# Altium schematic sheet MCU.SchDoc
size Letter; Organization: Altium Limited; Address1: L3, 12a Rodborough Rd; Address2: Frenchs Forest; Address3: NSW; Address4: Australia 2086
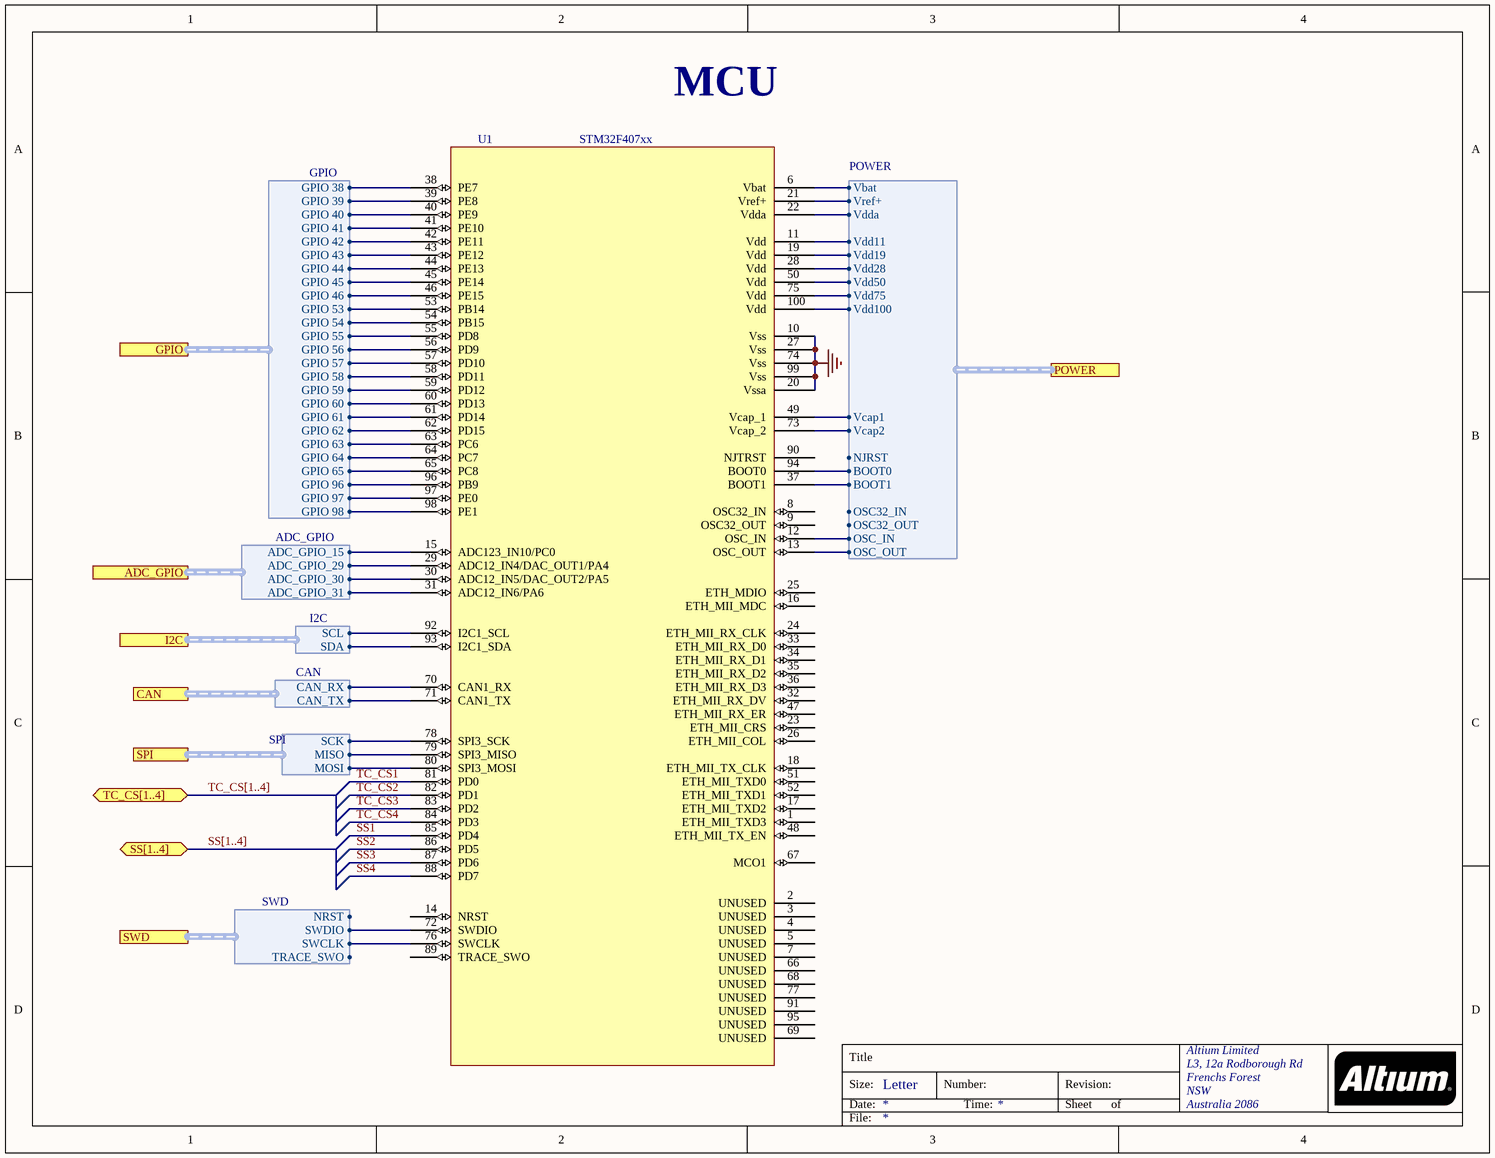
[diagram p0: MCU.SchDoc]

## Parts
U1  STM32F407xx  [LQFP100]

## Ports
ADC_GPIO (harness ADC_GPIO), CAN (harness CAN), GPIO (harness GPIO), I2C (harness I2C), POWER (harness POWER), SPI (harness SPI), SS[1..4] (bidir), SWD (harness SWD), TC_CS[1..4] (bidir)

## Harnesses
I2C: SCL, SDA
GPIO: GPIO 38, GPIO 39, GPIO 40, GPIO 41, GPIO 42, GPIO 43, GPIO 44, GPIO 45, GPIO 46, GPIO 53, GPIO 54, GPIO 55, GPIO 56, GPIO 57, GPIO 58, GPIO 59, GPIO 60, GPIO 61, GPIO 62, GPIO 63, GPIO 64, GPIO 65, GPIO 96, GPIO 97, GPIO 98
ADC_GPIO: ADC_GPIO_15, ADC_GPIO_29, ADC_GPIO_30, ADC_GPIO_31
CAN: CAN_RX, CAN_TX
SWD: NRST, SWDIO, SWCLK, TRACE_SWO
POWER: Vbat, Vref+, Vdda, Vcap1, Vcap2, NJRST, BOOT0, BOOT1, OSC32_IN, OSC32_OUT, OSC_IN, OSC_OUT, Vdd11, Vdd19, Vdd28, Vdd50, Vdd75, Vdd100
SPI: SCK, MISO, MOSI

## Nets
GND: U1.10(Vss) U1.20(Vssa) U1.27(Vss) U1.74(Vss) U1.99(Vss)
SS1: U1.85(PD4)
SS2: U1.86(PD5)
SS3: U1.87(PD6)
SS4: U1.88(PD7)
TC_CS1: U1.81(PD0)
TC_CS2: U1.82(PD1)
TC_CS3: U1.83(PD2)
TC_CS4: U1.84(PD3)
NetU1_6: U1.6(Vbat) ; port POWER.Vbat
NetU1_11: U1.11(Vdd) ; port POWER.Vdd11
NetU1_12: U1.12(OSC_IN) ; port POWER.OSC_IN
NetU1_13: U1.13(OSC_OUT) ; port POWER.OSC_OUT
NetU1_15: U1.15(ADC123_IN10/PC0) ; port ADC_GPIO.ADC_GPIO_15
NetU1_19: U1.19(Vdd) ; port POWER.Vdd19
NetU1_21: U1.21(Vref+) ; port POWER.Vref+
NetU1_22: U1.22(Vdda) ; port POWER.Vdda
NetU1_28: U1.28(Vdd) ; port POWER.Vdd28
NetU1_29: U1.29(ADC12_IN4/DAC_OUT1/PA4) ; port ADC_GPIO.ADC_GPIO_29
NetU1_30: U1.30(ADC12_IN5/DAC_OUT2/PA5) ; port ADC_GPIO.ADC_GPIO_30
NetU1_31: U1.31(ADC12_IN6/PA6) ; port ADC_GPIO.ADC_GPIO_31
NetU1_37: U1.37(BOOT1) ; port POWER.BOOT1
NetU1_38: U1.38(PE7) ; port GPIO.GPIO 38
NetU1_39: U1.39(PE8) ; port GPIO.GPIO 39
NetU1_40: U1.40(PE9) ; port GPIO.GPIO 40
NetU1_41: U1.41(PE10) ; port GPIO.GPIO 41
NetU1_42: U1.42(PE11) ; port GPIO.GPIO 42
NetU1_43: U1.43(PE12) ; port GPIO.GPIO 43
NetU1_44: U1.44(PE13) ; port GPIO.GPIO 44
NetU1_45: U1.45(PE14) ; port GPIO.GPIO 45
NetU1_46: U1.46(PE15) ; port GPIO.GPIO 46
NetU1_49: U1.49(Vcap_1) ; port POWER.Vcap1
NetU1_50: U1.50(Vdd) ; port POWER.Vdd50
NetU1_53: U1.53(PB14) ; port GPIO.GPIO 53
NetU1_54: U1.54(PB15) ; port GPIO.GPIO 54
NetU1_55: U1.55(PD8) ; port GPIO.GPIO 55
NetU1_56: U1.56(PD9) ; port GPIO.GPIO 56
NetU1_57: U1.57(PD10) ; port GPIO.GPIO 57
NetU1_58: U1.58(PD11) ; port GPIO.GPIO 58
NetU1_59: U1.59(PD12) ; port GPIO.GPIO 59
NetU1_60: U1.60(PD13) ; port GPIO.GPIO 60
NetU1_61: U1.61(PD14) ; port GPIO.GPIO 61
NetU1_62: U1.62(PD15) ; port GPIO.GPIO 62
NetU1_63: U1.63(PC6) ; port GPIO.GPIO 63
NetU1_64: U1.64(PC7) ; port GPIO.GPIO 64
NetU1_65: U1.65(PC8) ; port GPIO.GPIO 65
NetU1_70: U1.70(CAN1_RX) ; port CAN.CAN_RX
NetU1_71: U1.71(CAN1_TX) ; port CAN.CAN_TX
NetU1_72: U1.72(SWDIO) ; port SWD.SWDIO
NetU1_73: U1.73(Vcap_2) ; port POWER.Vcap2
NetU1_75: U1.75(Vdd) ; port POWER.Vdd75
NetU1_76: U1.76(SWCLK) ; port SWD.SWCLK
NetU1_78: U1.78(SPI3_SCK) ; port SPI.SCK
NetU1_79: U1.79(SPI3_MISO) ; port SPI.MISO
NetU1_80: U1.80(SPI3_MOSI) ; port SPI.MOSI
NetU1_92: U1.92(I2C1_SCL) ; port I2C.SCL
NetU1_93: U1.93(I2C1_SDA) ; port I2C.SDA
NetU1_94: U1.94(BOOT0) ; port POWER.BOOT0
NetU1_96: U1.96(PB9) ; port GPIO.GPIO 96
NetU1_97: U1.97(PE0) ; port GPIO.GPIO 97
NetU1_98: U1.98(PE1) ; port GPIO.GPIO 98
NetU1_100: U1.100(Vdd) ; port POWER.Vdd100

Not connected (* = marked no-connect by the designer): U1 1(ETH_MII_TXD3) 2(UNUSED) 3(UNUSED) 4(UNUSED) 5(UNUSED) 7(UNUSED) 8(OSC32_IN) 9(OSC32_OUT) 14(NRST) 16(ETH_MII_MDC) 17(ETH_MII_TXD2) 18(ETH_MII_TX_CLK) 23(ETH_MII_CRS) 24(ETH_MII_RX_CLK) 25(ETH_MDIO) 26(ETH_MII_COL) 32(ETH_MII_RX_DV) 33(ETH_MII_RX_D0) 34(ETH_MII_RX_D1) 35(ETH_MII_RX_D2) 36(ETH_MII_RX_D3) 47(ETH_MII_RX_ER) 48(ETH_MII_TX_EN) 51(ETH_MII_TXD0) 52(ETH_MII_TXD1) 66(UNUSED) 67(MCO1) 68(UNUSED) 69(UNUSED) 77(UNUSED) 89(TRACE_SWO) 90(NJTRST) 91(UNUSED) 95(UNUSED)

## Buses and harness runs
bus SS[1..4] = port SS[1..4]
bus TC_CS[1..4] = port TC_CS[1..4]

## Notes on the sheet
- MCU
- Title
- Size:
- Date:
- Letter
- Number:
- Time:
- Revision:
- Sheet
- of
- File: